# EAGLE design esp32-poe-thermocouple-hat (EAGLE 7.7.0)
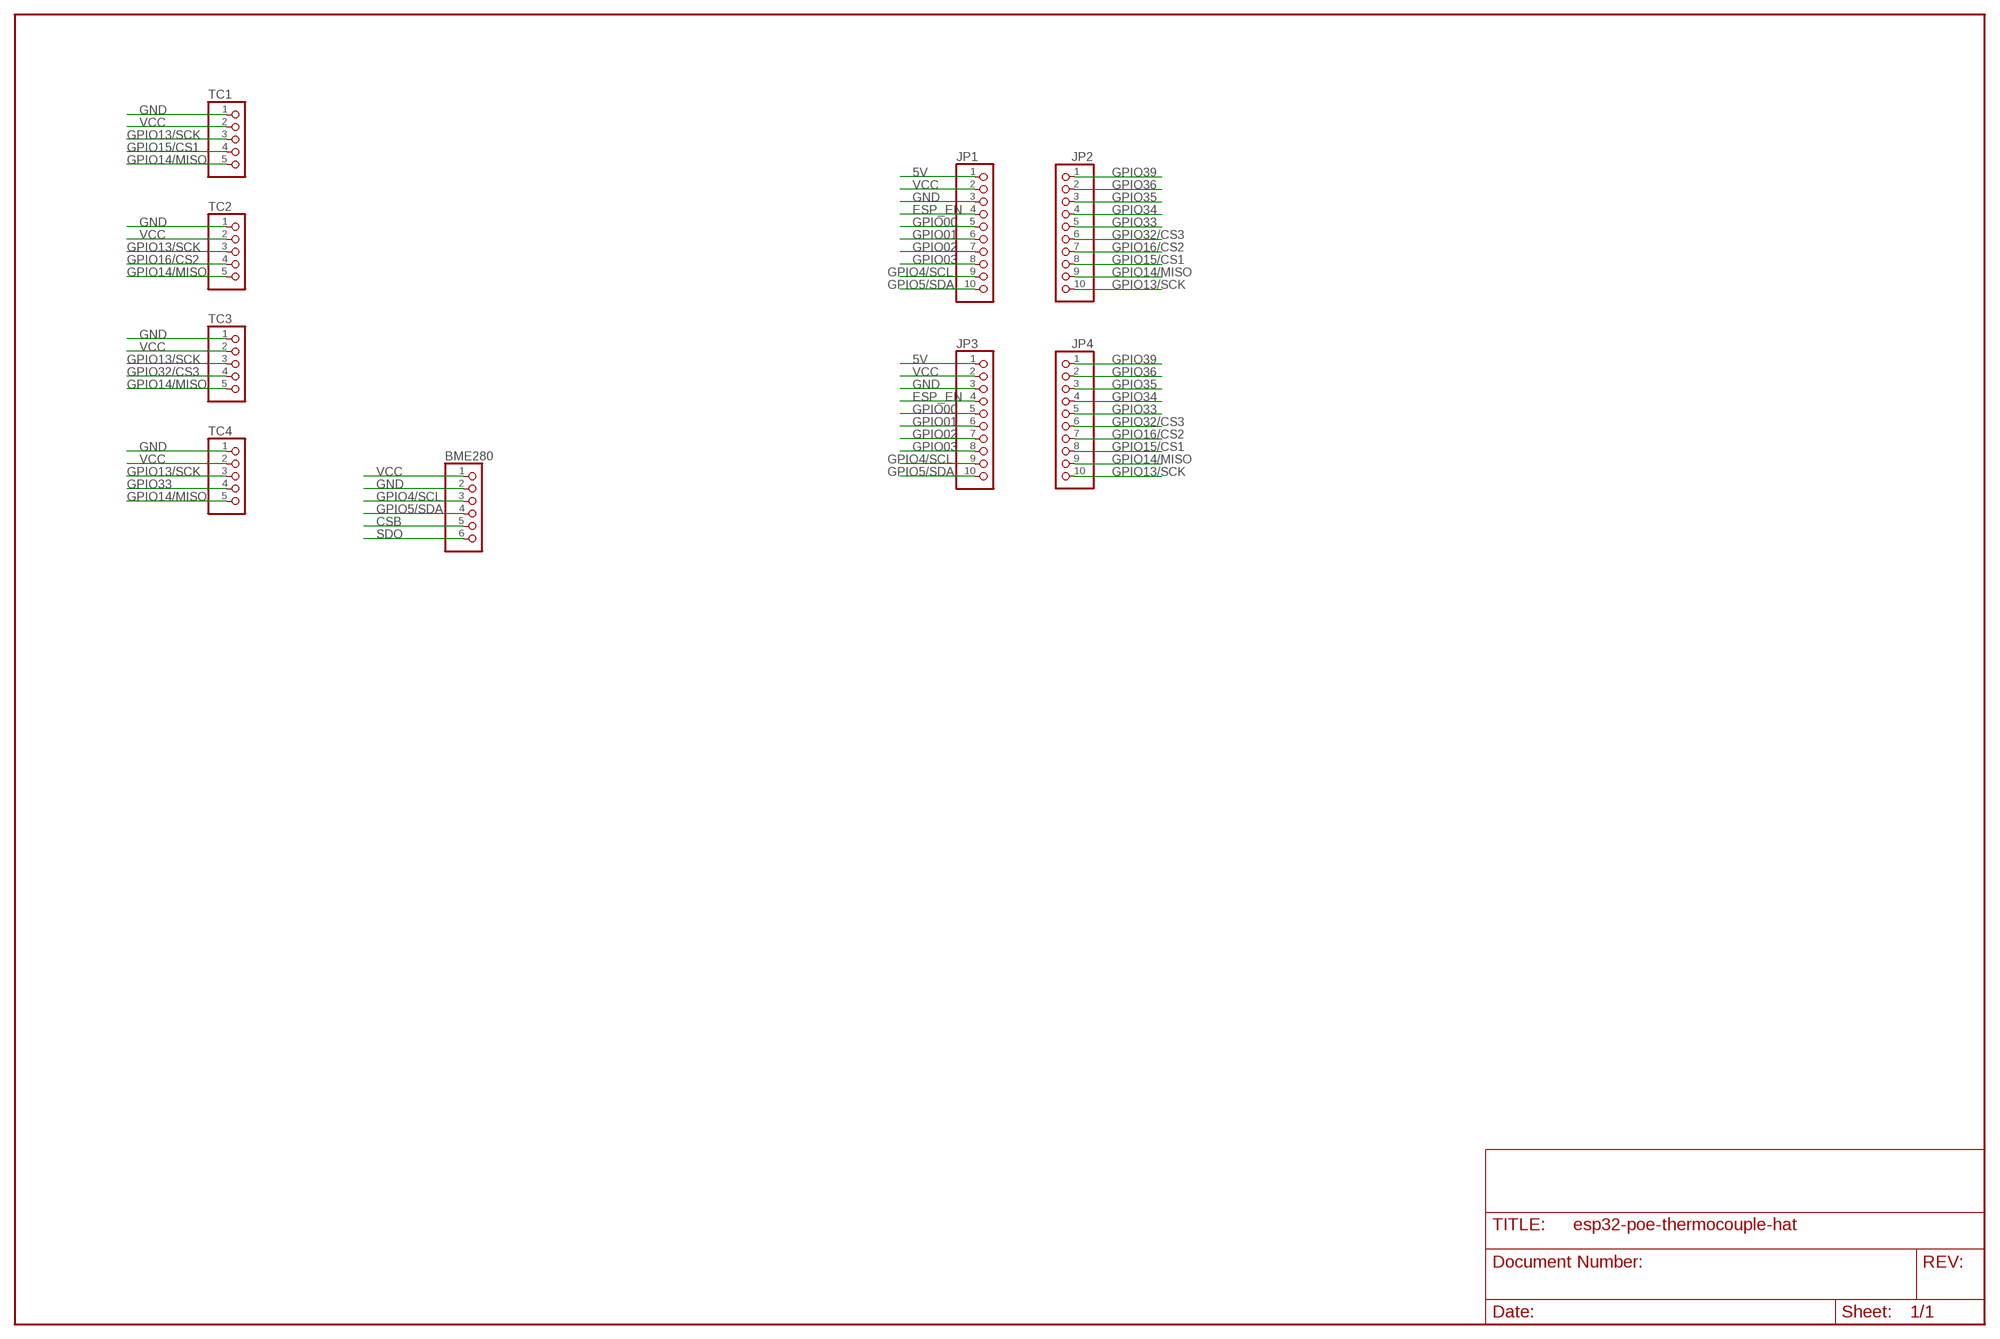
[diagram p0: schematic, sheet 1]

## Parts
BME280  PINHD-1X6  [1X06]
JP1  PINHD-1X10  [1X10]
JP2  PINHD-1X10  [1X10]
JP3  PINHD-1X10  [1X10]
JP4  PINHD-1X10  [1X10]
TC1  PINHD-1X5  [1X05]
TC2  PINHD-1X5  [1X05]
TC3  PINHD-1X5  [1X05]
TC4  PINHD-1X5  [1X05]

## Nets
5V: JP1.1 JP3.1
CSB: BME280.5
ESP_EN: JP1.4 JP3.4
GND: BME280.2 JP1.3 JP3.3 TC1.1 TC2.1 TC3.1 TC4.1
GPIO00: JP1.5 JP3.5
GPIO01: JP1.6 JP3.6
GPIO02: JP1.7 JP3.7
GPIO03: JP1.8 JP3.8
GPIO4/SCL: BME280.3 JP1.9 JP3.9
GPIO5/SDA: BME280.4 JP1.10 JP3.10
GPIO13/SCK: JP2.10 JP4.10 TC1.3 TC2.3 TC3.3 TC4.3
GPIO14/MISO: JP2.9 JP4.9 TC1.5 TC2.5 TC3.5 TC4.5
GPIO15/CS1: JP2.8 JP4.8 TC1.4
GPIO16/CS2: JP2.7 JP4.7 TC2.4
GPIO32/CS3: JP2.6 JP4.6 TC3.4
GPIO33: JP2.5 JP4.5 TC4.4
GPIO34: JP2.4 JP4.4
GPIO35: JP2.3 JP4.3
GPIO36: JP2.2 JP4.2
GPIO39: JP2.1 JP4.1
SDO: BME280.6
VCC: BME280.1 JP1.2 JP3.2 TC1.2 TC2.2 TC3.2 TC4.2

## Library data of the parts
BME280 = pinhead:PINHD-1X6: PIN HEADER
JP1-JP4 = pinhead:PINHD-1X10: PIN HEADER
TC1-TC4 = pinhead:PINHD-1X5: PIN HEADER

## Board
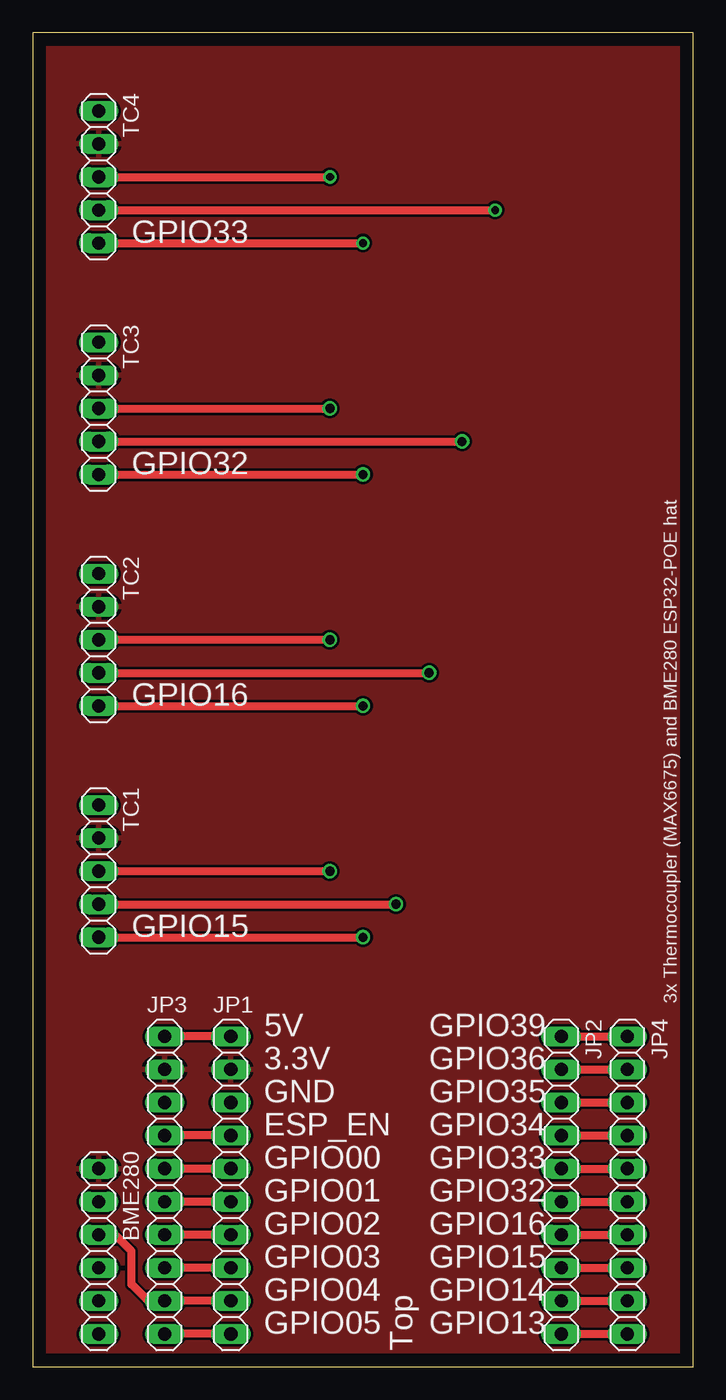
[diagram p1: board, top side]
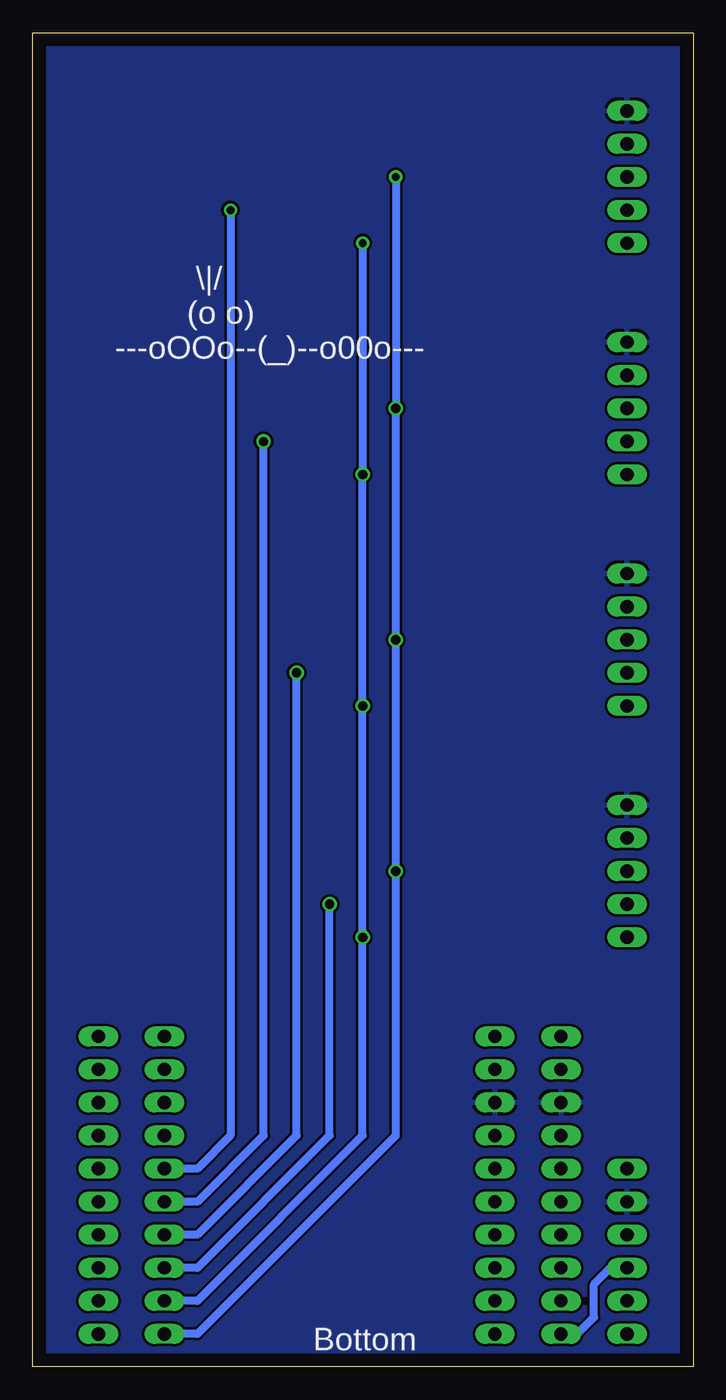
[diagram p2: board, bottom side, seen from below]

Size 50.78 x 102.54 mm. Coordinates in mm from the lower left corner, seen from the top.
Outline: 0,0 50.78,0 50.78,102.54 0,102.54 0,0
Copper layers (1*16): Top 0.035mm / dielectric 1.5mm / Bottom 0.035mm
Design rules "default": minimum track width 10mil, minimum drill 24mil, track to track 8mil, track to pad 8mil, pad to pad 8mil, via to via 8mil, smd to smd 8mil, copper to edge 40mil, drill to drill 8mil, minimum pad ring 10mil, minimum via ring 8mil, stop-mask expansion 4mil, vias tented up to drill 0mil, thermal gap 10mil

### Footprints (pad centres in the part's own frame; a part is rotated, then mirrored left to right if it is on the bottom)
1X06 = drill 1.016 long: 1 -6.35,0; 2 -3.81,0; 3 -1.27,0; 4 1.27,0; 5 3.81,0; 6 6.35,0
1X10 = drill 1.016 long: 1 -11.43,0; 2 -8.89,0; 3 -6.35,0; 4 -3.81,0; 5 -1.27,0; 6 1.27,0; 7 3.81,0; 8 6.35,0; 9 8.89,0; 10 11.43,0
1X05 = drill 1.016 long: 1 -5.08,0; 2 -2.54,0; 3 0,0; 4 2.54,0; 5 5.08,0

### Placement (x,y rotation side)
BME280  5.08,8.89 270 top
JP1  15.24,13.97 270 top
JP2  40.64,13.97 270 top
JP3  10.16,13.97 270 top
JP4  45.72,13.97 270 top
TC1  5.08,38.1 270 top
TC2  5.08,55.88 270 top
TC3  5.08,73.66 270 top
TC4  5.08,91.44 270 top

### Tracks (layer width: path | path; a pad name or v marks a point on that pad's centre or on a via)
5V
  Top 0.61: JP1.1 JP3.1
ESP_EN
  Top 0.61: JP1.4 JP3.4
GND
  pour Bottom: -5.08,106.68 54.61,106.68 54.61,-5.08 -5.08,-5.08
GPIO00
  Top 0.61: JP1.5 JP3.5
GPIO01
  Top 0.61: JP1.6 JP3.6
GPIO02
  Top 0.61: JP1.7 JP3.7
GPIO03
  Top 0.61: JP1.8 JP3.8
GPIO4/SCL
  Top 0.61: JP1.9 JP3.9 8.89,5.08 7.62,6.35 7.62,8.89 6.35,10.16 BME280.3
GPIO5/SDA
  Top 0.61: JP1.10 JP3.10
  Bottom 0.61: JP3.10 8.89,2.54 7.62,3.81 7.62,6.35 6.35,7.62 BME280.4
GPIO13/SCK  (via drill 0.6, 0.7)
  Top 0.61: JP2.10 JP4.10 | TC3.3 v22.86,73.66 | TC2.3 v22.86,55.88 | TC1.3 v22.86,38.1 | TC4.3 v22.86,91.44
  Bottom 0.61: JP2.10 38.1,2.54 22.86,17.78 v22.86,38.1 v22.86,55.88 v22.86,73.66 v22.86,91.44
GPIO14/MISO  (via drill 0.6, 0.7)
  Top 0.61: JP2.9 JP4.9 | TC3.5 v25.4,68.58 | TC2.5 v25.4,50.8 | TC1.5 v25.4,33.02 | TC4.5 v25.4,86.36
  Bottom 0.61: JP2.9 38.1,5.08 25.4,17.78 v25.4,33.02 v25.4,50.8 v25.4,68.58 v25.4,86.36
GPIO15/CS1  (via drill 0.7)
  Top 0.61: JP2.8 JP4.8 | TC1.4 v27.94,35.56
  Bottom 0.61: v27.94,35.56 27.94,17.78 38.1,7.62 JP2.8
GPIO16/CS2  (via drill 0.7)
  Top 0.61: JP2.7 JP4.7 | TC2.4 v30.48,53.34
  Bottom 0.61: v30.48,53.34 30.48,17.78 38.1,10.16 JP2.7
GPIO32/CS3  (via drill 0.7)
  Top 0.61: JP2.6 JP4.6 | TC3.4 v33.02,71.12
  Bottom 0.61: v33.02,71.12 33.02,17.78 38.1,12.7 JP2.6
GPIO33  (via drill 0.6)
  Top 0.61: JP2.5 JP4.5 | TC4.4 v35.56,88.9
  Bottom 0.61: v35.56,88.9 35.56,17.78 38.1,15.24 JP2.5
GPIO34
  Top 0.61: JP2.4 JP4.4
GPIO35
  Top 0.61: JP2.3 JP4.3
GPIO36
  Top 0.61: JP2.2 JP4.2
GPIO39
  Top 0.61: JP2.1 JP4.1
VCC
  pour Top: 52.07,104.14 -2.54,104.14 -2.54,-2.54 52.07,-2.54

### Text on the board
tPlace: GPIO33 | GPIO32 | GPIO16 | GPIO15 | 3x Thermocoupler (MAX6675) and BME280 ESP32-POE hat | 5V | GPIO39 | 3.3V | GPIO36 | GND | GPIO35 | ESP_EN | GPIO34 | GPIO00 | GPIO33 | GPIO01 | GPIO32 | GPIO02 | GPIO16 | GPIO03 | GPIO15 | GPIO04 | GPIO14 | GPIO05 | GPIO13 | Top
bPlace: \\|/ / (o o) / ---oOOo--(_)--o00o--- | Bottom
tStop: ::/-1 - Invalid.Network